# EAGLE design outin_shield_ethernet (EAGLE 6.5.0)
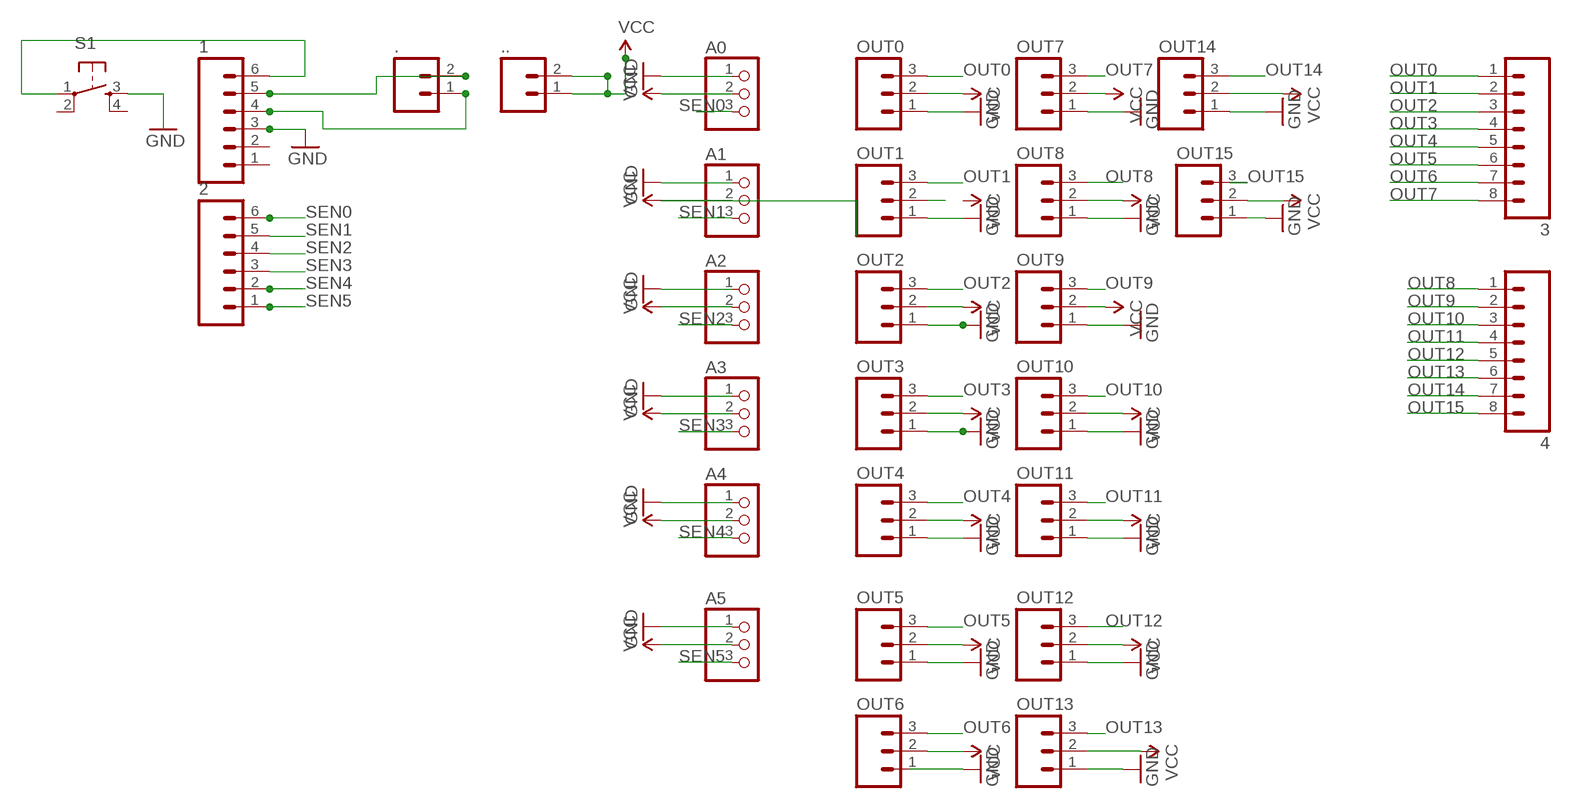
[diagram p0: schematic, sheet 1]

## Parts
1  M06SIP  [1X06]
2  M06SIP  [1X06]
3  M081X08  [1X08]
4  M081X08  [1X08]
.  M02LOCK  [1X02_LOCK]
..  M02LOCK  [1X02_LOCK]
A0  PINHD-1X3  [1X03]
A1  PINHD-1X3  [1X03]
A2  PINHD-1X3  [1X03]
A3  PINHD-1X3  [1X03]
A4  PINHD-1X3  [1X03]
A5  PINHD-1X3  [1X03]
OUT0  M03PTH  [1X03]
OUT1  M03PTH  [1X03]
OUT2  M03PTH  [1X03]
OUT3  M03PTH  [1X03]
OUT4  M03PTH  [1X03]
OUT5  M03PTH  [1X03]
OUT6  M03PTH  [1X03]
OUT7  M03PTH  [1X03]
OUT8  M03PTH  [1X03]
OUT9  M03PTH  [1X03]
OUT10  M03PTH  [1X03]
OUT11  M03PTH  [1X03]
OUT12  M03PTH  [1X03]
OUT13  M03PTH  [1X03]
OUT14  M03PTH  [1X03]
OUT15  M03PTH  [1X03]
S1  TAC_SWITCHPTH  [TACTILE-PTH]

## Nets
GND: 1.3 A0.1 A1.1 A2.1 A3.1 A4.1 A5.1 OUT0.1 OUT1.1 OUT2.1 OUT3.1 OUT4.1 OUT5.1 OUT7.1 OUT8.1 OUT9.1 OUT10.1 OUT11.1 OUT12.1 OUT13.1 OUT14.1 OUT15.1
N$1: 1.6 S1.1
N$2: S1.3
N$11: OUT1.2
N$22: 1.4 ..1
N$23: 1.5 ..2
OUT0: 3.1 OUT0.3
OUT1: 3.2 OUT1.3
OUT2: 3.3 OUT2.3
OUT3: 3.4 OUT3.3
OUT4: 3.5 OUT4.3
OUT5: 3.6 OUT5.3
OUT6: 3.7 OUT6.3
OUT7: 3.8 OUT7.3
OUT8: 4.1 OUT8.3
OUT9: 4.2 OUT9.3
OUT10: 4.3 OUT10.3
OUT11: 4.4 OUT11.3
OUT12: 4.5 OUT12.3
OUT13: 4.6 OUT13.3
OUT14: 4.7 OUT14.3
OUT15: 4.8 OUT15.3
SEN0: 2.6 A0.3
SEN1: 2.5 A1.3
SEN2: 2.4 A2.3
SEN3: 2.3 A3.3
SEN4: 2.2 A4.3
SEN5: 2.1 A5.3
VCC: ...1 ...2 A0.2 A1.2 A2.2 A3.2 A4.2 A5.2 OUT0.2 OUT2.2 OUT3.2 OUT4.2 OUT5.2 OUT6.2 OUT7.2 OUT8.2 OUT9.2 OUT10.2 OUT11.2 OUT12.2 OUT13.2 OUT14.2 OUT15.2
Unconnected: 1.1 1.2 OUT6.1 S1.2 S1.4

## Library data of the parts
1 2 = SparkFun:M06: Header 6 Standard 6-pin 0.1" header. Use with straight break away headers (SKU : PRT-00116), right angle break away headers (PRT-00553), swiss pins (PRT-00743), machine pins (PRT-00117), and female headers (PRT-00115). Molex polarized connector foot print use with SKU : PRT-08094 with associated crimp pins and housings. NOTES ON THE VARIANTS LOCK and LOCK_LONGPADS... This footprint was designed to help hold the alignment of a through-hole component (i.e. 6-pin header) while soldering it into place. You may notice that each hole has been shifted either up or down by 0.005 of an inch from it's more standard position (which is a perfectly straight line). This slight alteration caused the pins (the squares in the middle) to touch the edges of the holes. Because they are alternating, it causes a "brace" to hold the component in place. 0.005 has proven to be the perfect amount of "off-center" position when using our standard breakaway headers. Although looks a little odd when you look at the bare footprint, once you have a header in there, the alteration is very hard to notice. Also, if you push a header all the way into place, it is covered up entirely on the bottom side. This idea of altering the position of holes to aid alignment will be further integrated into the Sparkfun Library for other footprints. It can help hold any component with 3 or more connection pins.
3 4 = SparkFun:M08: Header 8 Standard 8-pin 0.1" header. Use with straight break away headers (SKU : PRT-00116), right angle break away headers (PRT-00553), swiss pins (PRT-00743), machine pins (PRT-00117), and female headers (PRT-00115).
. .. = SparkFun:M02: Header 2 Standard 2-pin 0.1" header. Use with straight break away headers (SKU : PRT-00116), right angle break away headers (PRT-00553), swiss pins (PRT-00743), machine pins (PRT-00117), and female headers (PRT-00115). Molex polarized connector foot print use with SKU : PRT-08233 with associated crimp pins and housings.
A0 A1-A5 = adafruit:PINHD-1X3: PIN HEADER
OUT0 OUT1-OUT15 = SparkFun:M03: Header 3 Standard 3-pin 0.1" header. Use with straight break away headers (SKU : PRT-00116), right angle break away headers (PRT-00553), swiss pins (PRT-00743), machine pins (PRT-00117), and female headers (PRT-00115). Molex polarized connector foot print use with SKU : PRT-08232 with associated crimp pins and housings.
S1 = SparkFun-3-2-07:TAC_SWITCH: Momentary Switch Button commonly used for reset or general input. Spark Fun Electronics SKU : Comp-PBS

## Board
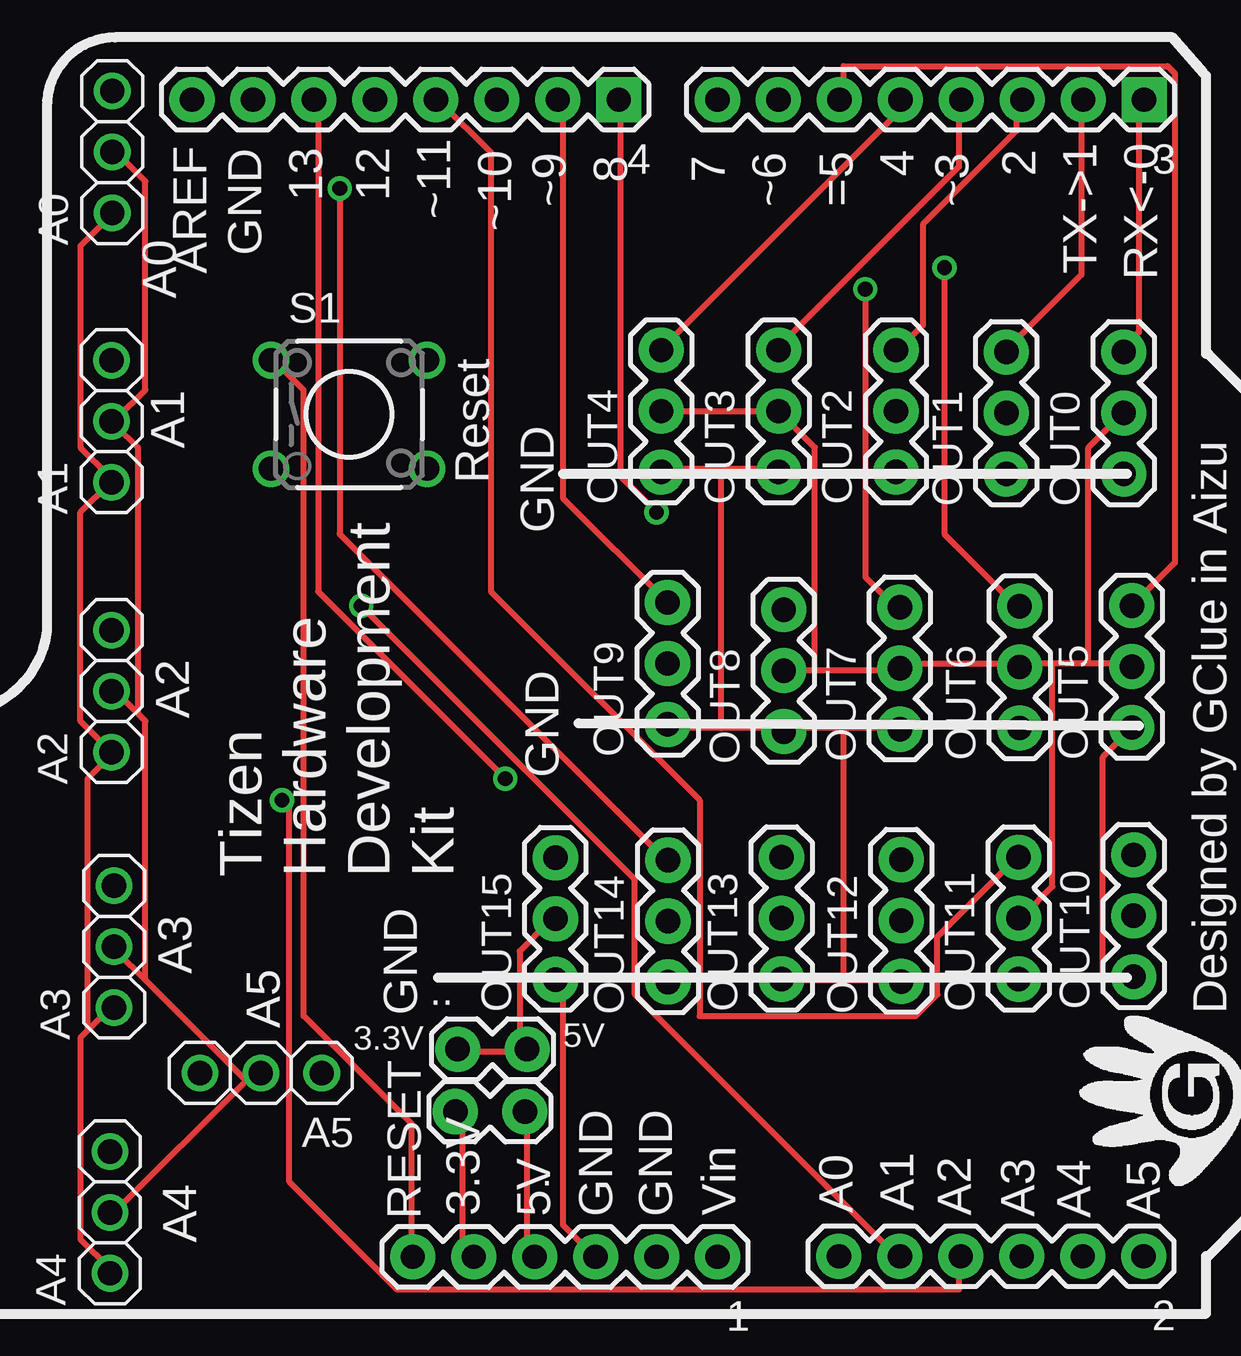
[diagram p1: board, top side]
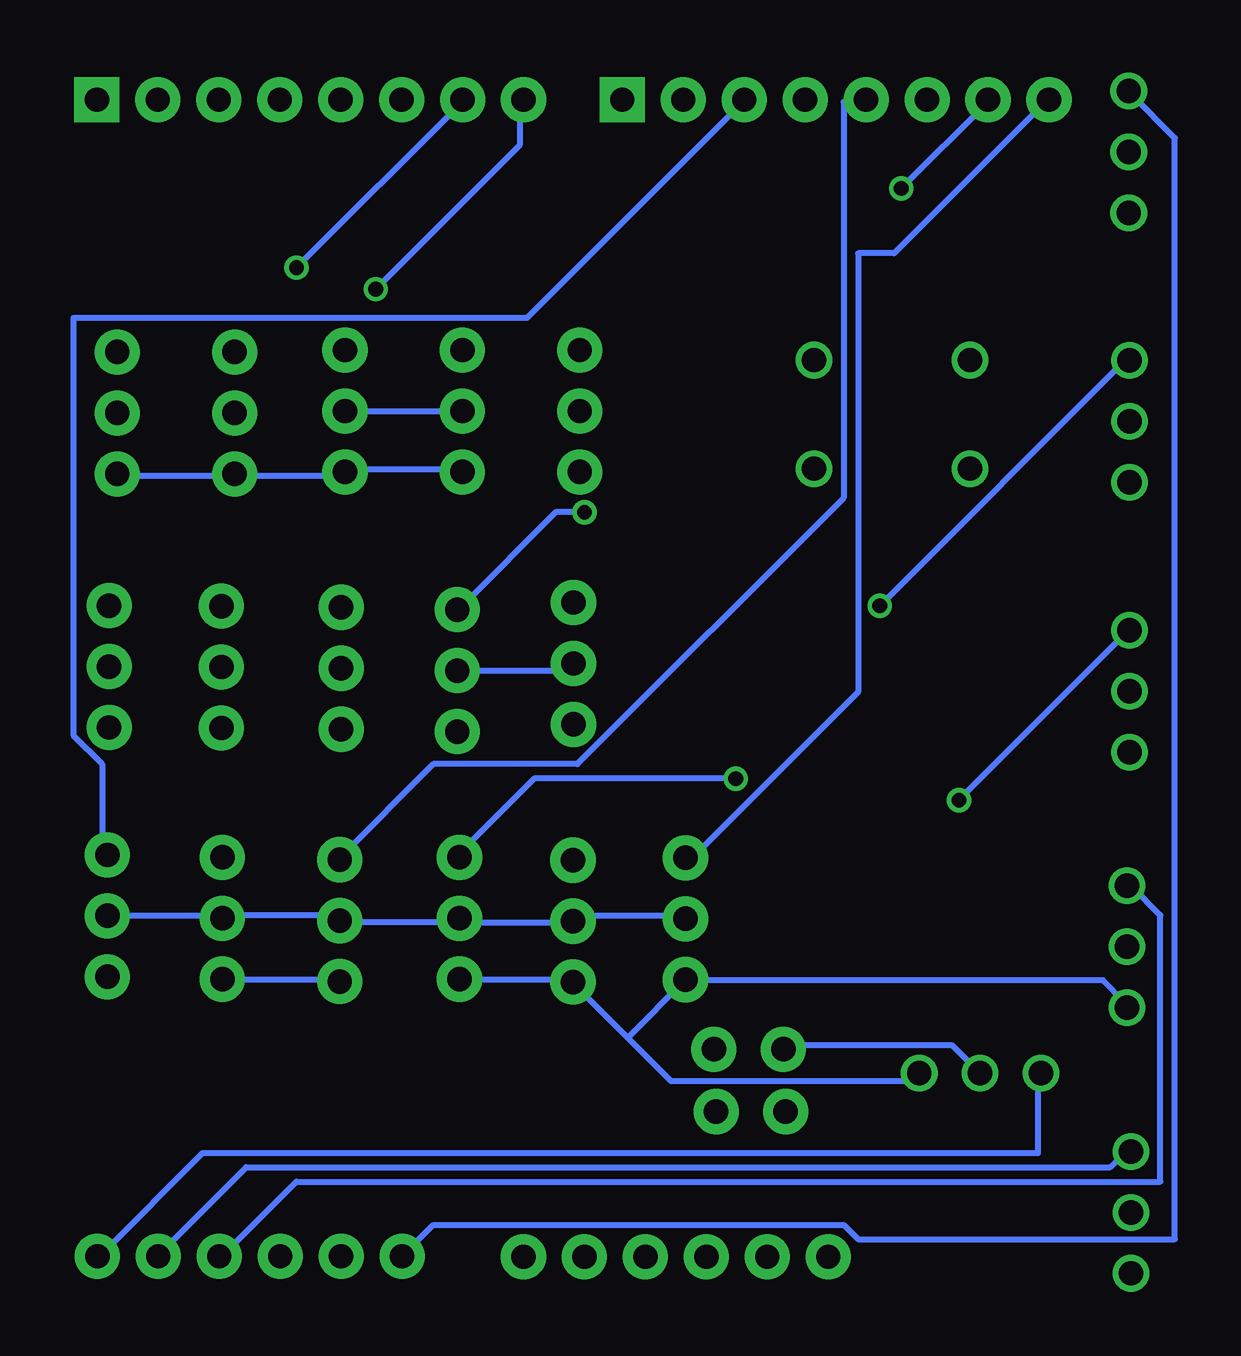
[diagram p2: board, bottom side, seen from below]

No outline drawn. Coordinates in mm, seen from the top.
Copper layers (1*16): Top 0.035mm / dielectric 1.5mm / Bottom 0.035mm
Design rules "default": minimum track width 10mil, minimum drill 24mil, track to track 8mil, track to pad 8mil, pad to pad 8mil, via to via 8mil, smd to smd 8mil, copper to edge 40mil, drill to drill 8mil, minimum pad ring 10mil, minimum via ring 8mil, stop-mask expansion 4mil, vias tented up to drill 0mil, thermal gap 10mil

### Footprints (pad centres in the part's own frame; a part is rotated, then mirrored left to right if it is on the bottom)
1X06 = drill 1.016 pad 1.88: 1 0,0; 2 2.54,0; 3 5.08,0; 4 7.62,0; 5 10.16,0; 6 12.7,0
1X08 = drill 1.016 pad 1.88 square: 1 0,0 | drill 1.016 pad 1.88: 2 2.54,0; 3 5.08,0; 4 7.62,0; 5 10.16,0; 6 12.7,0; 7 15.24,0; 8 17.78,0
1X02_LOCK = drill 1.016 pad 1.88: 1 -0.178,0; 2 2.718,0
1X03 = drill 1.016: 1 -2.54,0; 2 0,0; 3 2.54,0
1X03' = drill 1.016 pad 1.88: 1 0,0; 2 2.54,0; 3 5.08,0
TACTILE-PTH = drill 1.016: 1 -3.251,2.261; 2 3.251,2.261; 3 -3.251,-2.261; 4 3.251,-2.261

### Placement (x,y rotation side)
1  45.74,2.57 180 top
2  63.5,2.59 180 top
3  63.52,50.8 180 top
4  41.63,50.8 180 top
.  37.54,8.62 180 top
..  35.09,11.22 0 top
A0  20.52,48.62 90 top
A1  20.5,37.4 90 top
A2  20.5,26.14 90 top
A3  20.6,15.49 90 top
A4  20.42,4.42 90 top
A5  26.71,10.23 180 top
OUT0  [1X03']  62.67,35.2 90 top
OUT1  [1X03']  57.78,35.2 90 top
OUT2  [1X03']  53.18,35.28 90 top
OUT3  [1X03']  48.29,35.28 90 top
OUT4  [1X03']  43.4,35.28 90 top
OUT5  [1X03']  63.01,24.63 90 top
OUT6  [1X03']  58.33,24.61 90 top
OUT7  [1X03']  53.34,24.56 90 top
OUT8  [1X03']  48.5,24.46 90 top
OUT9  [1X03']  43.66,24.76 90 top
OUT10  [1X03']  63.08,14.24 90 top
OUT11  [1X03']  58.29,14.14 90 top
OUT12  [1X03']  53.4,14.04 90 top
OUT13  [1X03']  48.41,14.14 90 top
OUT14  [1X03']  43.68,14.02 90 top
OUT15  [1X03']  38.99,14.12 90 top
S1  30.39,37.68 0 top

### Tracks (layer width: path | path; a pad name or v marks a point on that pad's centre or on a via)
GND
  Top 0.254: A0.1 20.4,45.9 19.2,44.7 19.2,36.3 20.4,35.1 A1.1 20.4,34.8 19.2,33.6 19.2,24.9 20.4,23.7 A2.1 20.4,23.4 19.5,22.5 19.5,12 | 19.5,12 20.4,12.9 A3.1 | 19.5,12 19.2,11.7 19.2,3.3 20.4,2.1 A4.1 | 45.9,35.4 48,35.4 OUT3.1 | 45.9,35.4 43.5,35.4 OUT4.1 | 61.8,14.1 63,14.1 OUT10.1 | 61.8,14.1 58.5,14.1 OUT11.1 | 61.8,14.1 61.8,23.4 63,24.6 OUT5.1 | 1.3 40.5,2.7 39.3,3.9 39.3,13.8 39,14.1 OUT15.1 | 51,24.6 53.1,24.6 OUT7.1 | 51,24.6 48.6,24.6 OUT8.1 48.3,24.6 45.9,24.6 | 45.9,24.6 43.8,24.6 OUT9.1 | 51,14.1 48.6,14.1 OUT13.1 | 51,14.1 53.4,14.1 OUT12.1 | 51,14.1 51,24.6 | 45.9,24.6 45.9,35.4
  Bottom 0.254: OUT0.1 62.4,35.1 57.9,35.1 OUT1.1 57.6,35.1 53.4,35.1 OUT2.1 53.1,35.4 48.3,35.4 OUT3.1 | 41.4,11.7 43.5,13.8 OUT14.1 43.8,14.1 48.3,14.1 OUT13.1 | 41.4,11.7 39.6,9.9 29.7,9.9 29.4,10.2 A5.1 | 41.4,11.7 39,14.1 OUT15.1 38.7,14.1 21.6,14.1 20.7,13.2 A3.1 | OUT11.1 58.2,14.1 53.4,14.1 OUT12.1
N$1
  Top 0.254: S1.1 27.3,39.9 28.5,38.7 28.5,12.6 33,8.1 33,2.7 1.6
N$22
  Top 0.254: 1.4 38.1,2.7 37.8,3 37.8,8.4 ..1
N$23
  Top 0.254: 1.5 35.4,2.7 35.1,3 35.1,8.4 ..2
OUT0
  Top 0.254: OUT0.3 62.7,40.5 63.3,41.1 63.3,50.7 3.1
OUT1
  Top 0.254: OUT1.3 57.9,40.5 60.9,43.5 60.9,50.7 3.2
OUT2
  Top 0.254: OUT2.3 53.4,40.5 54.3,41.4 54.3,45.6 58.2,49.5 58.2,50.7 3.3
OUT3
  Top 0.254: OUT3.3 48.3,40.5 55.8,48 55.8,50.7 3.4
OUT4
  Top 0.254: OUT4.3 43.5,40.5 53.1,50.1 53.1,50.7 3.5
OUT5
  Top 0.254: OUT5.3 64.8,31.5 64.8,51.9 64.5,52.2 51,52.2 51,51 3.6
OUT6  (via drill 0.61)
  Top 0.254: v55.2,43.8 55.2,32.7 58.2,29.7 OUT6.3
  Bottom 0.254: v55.2,43.8 48.3,50.7 3.7
OUT7  (via drill 0.61)
  Top 0.254: v51.9,42.9 51.9,30.9 53.1,29.7 OUT7.3
  Bottom 0.254: v51.9,42.9 45.9,48.9 45.9,50.7 3.8
OUT8  (via drill 0.61)
  Top 0.254: v43.2,33.6 41.7,35.1 41.7,50.7 4.1
  Bottom 0.254: v43.2,33.6 44.4,33.6 48.3,29.7 OUT8.3
OUT9
  Top 0.254: OUT9.3 39.3,34.2 39.3,50.7 4.2
OUT10
  Bottom 0.254: OUT10.3 63.3,19.5 63.3,23.1 64.5,24.3 64.5,41.7 45.6,41.7 36.6,50.7 4.3
OUT11
  Top 0.254: OUT11.3 58.2,19.2 54.9,15.9 54.9,13.5 54,12.6 45,12.6 45,21.6 36.3,30.3 36.3,48.6 34.2,50.7 4.4
OUT12
  Bottom 0.254: OUT12.3 53.4,19.2 49.5,23.1 43.5,23.1 32.4,34.2 32.4,50.7 31.5,50.7 4.5
OUT13  (via drill 0.61)
  Top 0.254: v36.9,22.5 29.1,30.3 29.1,50.7 4.6
  Bottom 0.254: v36.9,22.5 45.3,22.5 48.3,19.5 OUT13.3
OUT14  (via drill 0.61)
  Top 0.254: v30,47.1 30,32.7 43.5,19.2 OUT14.3
  Bottom 0.254: v30,47.1 26.4,50.7 4.7
OUT15
  Bottom 0.254: OUT15.3 38.7,19.2 31.8,26.1 31.8,44.4 30.3,44.4 24,50.7 4.8
SEN0
  Bottom 0.254: A0.3 20.4,51 18.6,49.2 18.6,3.3 31.8,3.3 32.4,3.9 49.5,3.9 50.7,2.7 2.6
SEN1  (via drill 0.61)
  Top 0.254: v30.9,29.7 42.3,18.3 42.3,13.5 53.1,2.7 2.5
  Bottom 0.254: v30.9,29.7 20.7,39.9 A1.3
SEN2  (via drill 0.61)
  Top 0.254: v27.6,21.6 27.9,21.3 27.9,5.7 32.4,1.2 55.8,1.2 55.8,2.4 2.4
  Bottom 0.254: v27.6,21.6 20.7,28.5 A2.3
SEN3
  Bottom 0.254: A3.3 20.4,18 19.2,16.8 19.2,5.7 55.2,5.7 58.2,2.7 2.3
SEN4
  Bottom 0.254: A4.3 20.7,6.9 21.3,6.3 57.3,6.3 60.9,2.7 2.2
SEN5
  Bottom 0.254: A5.3 24.3,10.2 24.3,6.9 59.1,6.9 63.3,2.7 2.1
VCC
  Top 0.254: 26.1,9.9 26.7,10.5 A5.2 26.1,9.9 | 26.1,9.9 20.7,4.5 A4.2 | 26.1,9.9 21.9,14.1 | 21.9,14.1 20.7,15.3 A3.2 | 21.6,25.2 21.9,24.9 21.9,14.1 | 21.6,25.2 20.7,26.1 A2.2 | 21.6,25.2 21.6,36.3 20.7,37.2 A1.2 20.7,37.5 21.9,38.7 21.9,47.4 20.7,48.6 A0.2 | 61.2,27.3 63,27.3 OUT5.2 | 61.2,27.3 59.7,27.3 | 59.7,27.3 58.5,27.3 OUT6.2 58.2,27.3 53.4,27.3 OUT7.2 53.1,27 49.8,27 | 61.2,27.3 61.2,36.3 62.4,37.5 OUT0.2 | OUT4.2 43.5,37.8 48,37.8 OUT3.2 48.3,37.8 49.8,36.3 49.8,27 | 49.8,27 OUT8.2 | ...1 35.1,11.1 37.8,11.1 ...2 37.8,11.4 37.5,11.7 37.5,15.3 38.7,16.5 OUT15.2 | 59.7,27.3 59.7,18 58.5,16.8 OUT11.2
  Bottom 0.254: OUT2.2 53.1,37.8 48.3,37.8 OUT3.2 | OUT8.2 44.1,27 43.8,27.3 OUT9.2 | OUT10.2 63,16.8 58.5,16.8 OUT11.2 58.2,16.8 53.4,16.8 OUT12.2 53.4,16.5 48.6,16.5 OUT13.2 48.3,16.5 43.8,16.5 OUT14.2 43.5,16.8 39,16.8 OUT15.2 | A5.2 27,10.5 27.9,11.4 34.8,11.4 ...1

### Text on the board
tPlace: 4 | 2 | 13 | 12 | 8 | 7 | ~11 | ~9 | ~6 | =5 | ~3 | A0 | ~10 | AREF | GND | TX->1 | RX<-0 | Reset | A1 | GND | A2 | GND | Tizen / Hardware / Development / Kit | A3 | GND | Designed by GClue in Aizu | A5 | 3.3V | 5V | A4 | RESET | 3.3V | 5V | GND | GND | Vin | A0 | A1 | A2 | A3 | A4 | A5